# Altium project S7_CAS_lepo3002.PrjPcb (part 3 of 4)

## Sheet PROB_S7CAS_PHY.SchDoc
size Tabloid; SheetNumber: 11; SheetTotal: 15; Sheet_Name: Ethernet Transceiver FPGA; Size: 11x17
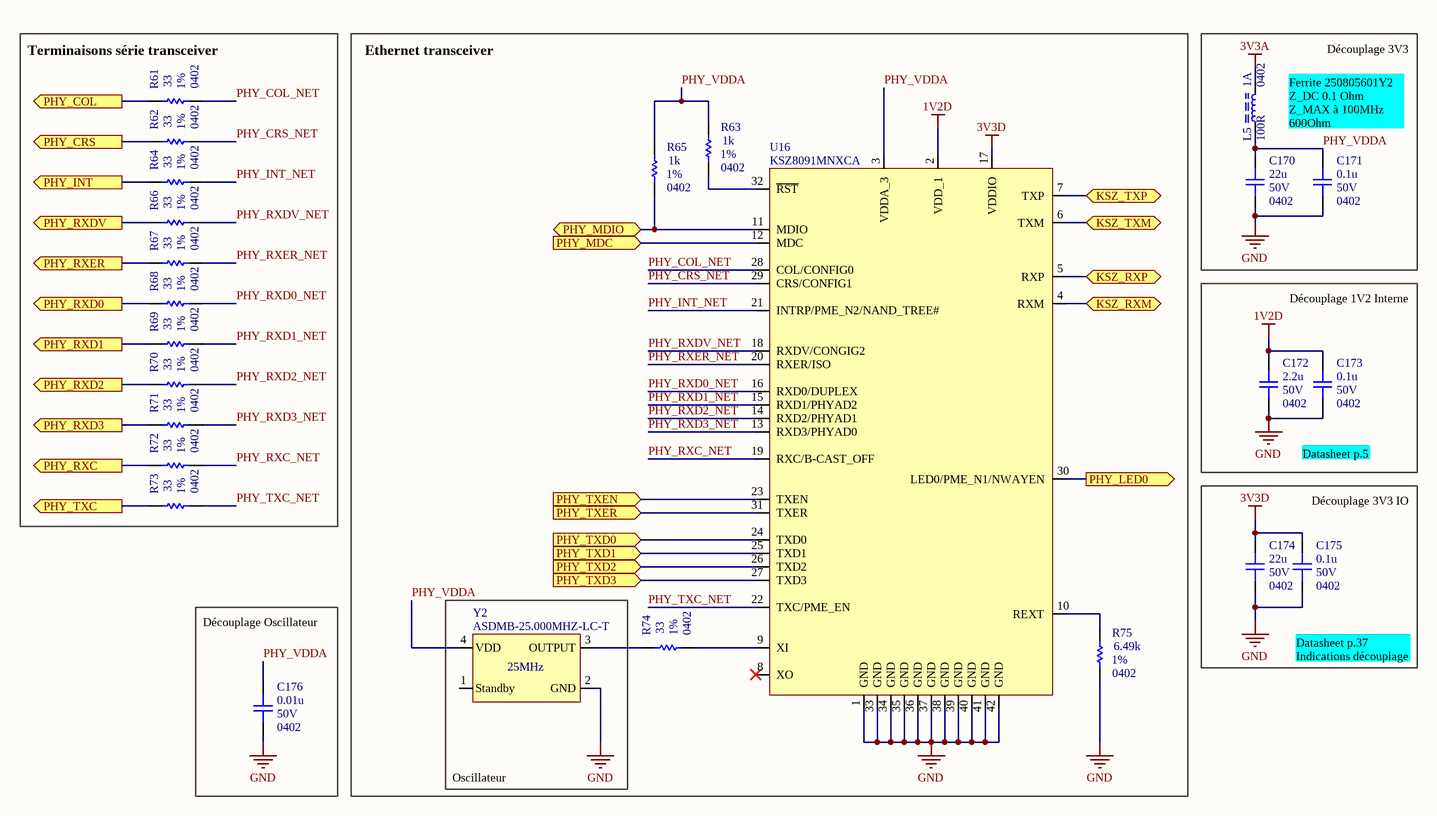
[diagram p10: PROB_S7CAS_PHY.SchDoc]

### Parts
C170  value 22u  Voltage: 50V  Package: 0402  [CAP_0402]  (hidden comment: CAP - 0402)
C171  value 0.1u  Voltage: 50V  Package: 0402  [CAP_0402]  (hidden comment: CAP - 0402)
C172  value 2.2u  Voltage: 50V  Package: 0402  [CAP_0402]  (hidden comment: CAP - 0402)
C173  value 0.1u  Voltage: 50V  Package: 0402  [CAP_0402]  (hidden comment: CAP - 0402)
C174  value 22u  Voltage: 50V  Package: 0402  [CAP_0402]  (hidden comment: CAP - 0402)
C175  value 0.1u  Voltage: 50V  Package: 0402  [CAP_0402]  (hidden comment: CAP - 0402)
C176  value 0.01u  Voltage: 50V  Package: 0402  [CAP_0402]  (hidden comment: CAP - 0402)
L5  value 100R  Current: 1A  Package: 0402  [FER_0402]  (hidden comment: FER - 0402)
R61  value 33  Package: 0402  Precision: 1%  [RES_0402]  (hidden comment: RES - 0402)
R62  value 33  Package: 0402  Precision: 1%  [RES_0402]  (hidden comment: RES - 0402)
R63  value 1k  Package: 0402  Precision: 1%  [RES_0402]  (hidden comment: RES - 0402)
R64  value 33  Package: 0402  Precision: 1%  [RES_0402]  (hidden comment: RES - 0402)
R65  value 1k  Package: 0402  Precision: 1%  [RES_0402]  (hidden comment: RES - 0402)
R66  value 33  Package: 0402  Precision: 1%  [RES_0402]  (hidden comment: RES - 0402)
R67  value 33  Package: 0402  Precision: 1%  [RES_0402]  (hidden comment: RES - 0402)
R68  value 33  Package: 0402  Precision: 1%  [RES_0402]  (hidden comment: RES - 0402)
R69  value 33  Package: 0402  Precision: 1%  [RES_0402]  (hidden comment: RES - 0402)
R70  value 33  Package: 0402  Precision: 1%  [RES_0402]  (hidden comment: RES - 0402)
R71  value 33  Package: 0402  Precision: 1%  [RES_0402]  (hidden comment: RES - 0402)
R72  value 33  Package: 0402  Precision: 1%  [RES_0402]  (hidden comment: RES - 0402)
R73  value 33  Package: 0402  Precision: 1%  [RES_0402]  (hidden comment: RES - 0402)
R74  value 33  Package: 0402  Precision: 1%  [RES_0402]  (hidden comment: RES - 0402)
R75  value 6.49k  Package: 0402  Precision: 1%  [RES_0402]  (hidden comment: RES - 0402)
U16  KSZ8091MNXCA  [COM_ETH_PHY_KSZ8091MNXCA]
Y2  ASDMB-25.000MHZ-LC-T  [OSC_ASDMB-25.000MHZ-LC-T]

### Ports
KSZ_RXM (bidir), KSZ_RXP (bidir), KSZ_TXM (bidir), KSZ_TXP (bidir), PHY_COL (out), PHY_CRS (out), PHY_INT (out), PHY_LED0 (out), PHY_MDC (in), PHY_MDIO (bidir), PHY_RXC (out), PHY_RXD0 (out), PHY_RXD1 (out), PHY_RXD2 (out), PHY_RXD3 (out), PHY_RXDV (out), PHY_RXER (out), PHY_TXC (out), PHY_TXD0 (in), PHY_TXD1 (in), PHY_TXD2 (in), PHY_TXD3 (in), PHY_TXEN (in), PHY_TXER (in)

### Nets
1V2D: C172.2 C173.2 U16.2(VDD_1)
3V3A: L5.1
3V3D: C174.2 C175.2 U16.17(VDDIO)
GND: C170.1 C171.1 C172.1 C173.1 C174.1 C175.1 C176.1 R75.1 U16.1(GND) U16.33(GND) U16.34(GND) U16.35(GND) U16.36(GND) U16.37(GND) U16.38(GND) U16.39(GND) U16.40(GND) U16.41(GND) U16.42(GND) Y2.2(GND)
KSZ_RXM: U16.4(RXM) ; port KSZ_RXM
KSZ_RXP: U16.5(RXP) ; port KSZ_RXP
KSZ_TXM: U16.6(TXM) ; port KSZ_TXM
KSZ_TXP: U16.7(TXP) ; port KSZ_TXP
PHY_COL: R61.2 ; port PHY_COL
PHY_COL_NET: R61.1 U16.28(COL/CONFIG0)
PHY_CRS: R62.2 ; port PHY_CRS
PHY_CRS_NET: R62.1 U16.29(CRS/CONFIG1)
PHY_INT: R64.2 ; port PHY_INT
PHY_INT_NET: R64.1 U16.21(INTRP/PME_N2/NAND_TREE#)
PHY_LED0: U16.30(LED0/PME_N1/NWAYEN) ; port PHY_LED0
PHY_MDC: U16.12(MDC) ; port PHY_MDC
PHY_MDIO: R65.1 U16.11(MDIO) ; port PHY_MDIO
PHY_RXC: R72.2 ; port PHY_RXC
PHY_RXC_NET: R72.1 U16.19(RXC/B-CAST_OFF)
PHY_RXD0: R68.2 ; port PHY_RXD0
PHY_RXD0_NET: R68.1 U16.16(RXD0/DUPLEX)
PHY_RXD1: R69.2 ; port PHY_RXD1
PHY_RXD1_NET: R69.1 U16.15(RXD1/PHYAD2)
PHY_RXD2: R70.2 ; port PHY_RXD2
PHY_RXD2_NET: R70.1 U16.14(RXD2/PHYAD1)
PHY_RXD3: R71.2 ; port PHY_RXD3
PHY_RXD3_NET: R71.1 U16.13(RXD3/PHYAD0)
PHY_RXDV: R66.2 ; port PHY_RXDV
PHY_RXDV_NET: R66.1 U16.18(RXDV/CONGIG2)
PHY_RXER: R67.2 ; port PHY_RXER
PHY_RXER_NET: R67.1 U16.20(RXER/ISO)
PHY_TXC: R73.2 ; port PHY_TXC
PHY_TXC_NET: R73.1 U16.22(TXC/PME_EN)
PHY_TXD0: U16.24(TXD0) ; port PHY_TXD0
PHY_TXD1: U16.25(TXD1) ; port PHY_TXD1
PHY_TXD2: U16.26(TXD2) ; port PHY_TXD2
PHY_TXD3: U16.27(TXD3) ; port PHY_TXD3
PHY_TXEN: U16.23(TXEN) ; port PHY_TXEN
PHY_TXER: U16.31(TXER) ; port PHY_TXER
PHY_VDDA: C170.2 C171.2 C176.2 L5.2 R63.2 R65.2 U16.3(VDDA_3) Y2.4(VDD)
NetR63_1: R63.1 U16.32(~{RST})
NetR74_1: R74.1 U16.9(XI)
NetR74_2: R74.2 Y2.3(OUTPUT)
NetR75_2: R75.2 U16.10(REXT)

Not connected (* = marked no-connect by the designer): U16 8(XO)*; Y2 1(Standby)

### Notes on the sheet
- (near R61) Terminaisons série transceiver
- Ethernet transceiver
- (near L5) Découplage 3V3
- Ferrite 250805601Y2 Z_DC 0.1 Ohm Z_MAX à 100MHz 600Ohm
- Découplage 1V2 Interne
- Datasheet p.5
- Découplage 3V3 IO
- Découplage Oscillateur
- Datasheet p.37 Indications découplage
- Oscillateur
- Sheet Name
- Project Title
- Global Project
- Size
- Group
- Revision
- Date
- Sheet
- of
- Filename
- Designers

### Library data of the parts
C170-C176 = CAP - 0402: Precision: 10%; Current: *; CreatedBy: Jonathan Bouchard; Power: *
R61-R75 = RES - 0402: Voltage: 50V; Power: 1/16W; Current: *; CreatedBy: Jonathan Bouchard
U16 = COM_ETH_PHY_KSZ8091MNXCA: COM - ETHERNET PHY 10/100 - QFN-32; Voltage: 1.8V, 2.5V, 3.3V; Mfg: Micrel; Current: *; Power: *; Mfg Part Number: KSZ8091MNXCA; HelpURL: http://ww1.microchip.com/downloads/en/DeviceDoc/00002275A.pdf; CreatedBy: Jonathan Bouchard; Temperature: 0°C ~ 70°C; Value: *; Precision: *; Package: QFN-32; Supplier 1: Digikey; Supplier Part Number 1: 576-4356-ND
Y2 = OSC_ASDMB-25.000MHZ-LC-T: OSC - 25MHz XO (Standard) LVCMOS - 4-SMD, No Lead; Manufacturer #1: Abracon LLC; Tolerance: ±50ppm; Voltage Rating: 1.8V ~ 3.3V; GRAMS Lib Spec: 2.8; Magnetic Material: Unknown; Polarized: Yes; Value: 25MHz; Current Rating: *; Power Max: *; HelpURL: https://abracon.com/Oscillators/ASDMB.pdf; CreatedBy/Date: Joël Lemay 2019-03-29; VerifiedBy: C. Paulin - 29 mai 2019; Temperature: -40°C ~ +85°C; Package: 4-SMD, No Lead; Manufacturer #2: *; Note: *; Assembly Type: SMD; Part Number #2: *; Part Number #1: ASDMB-25.000MHZ-LC-T; Supplier 1: Digi-Key; Supplier Part Number 1: 535-11730-1-ND; Cryo: UNKNOWN
L5 = FER - 0402: Voltage: *; CreatedBy: Jonathan Bouchard; Power: *; Precision: *

## Sheet PROB_S7CAS_DAC.SchDoc
size Tabloid; SheetNumber: 12; SheetTotal: 15; Sheet_Name: Convertisseur Numérique à Analogique; Size: 11x17
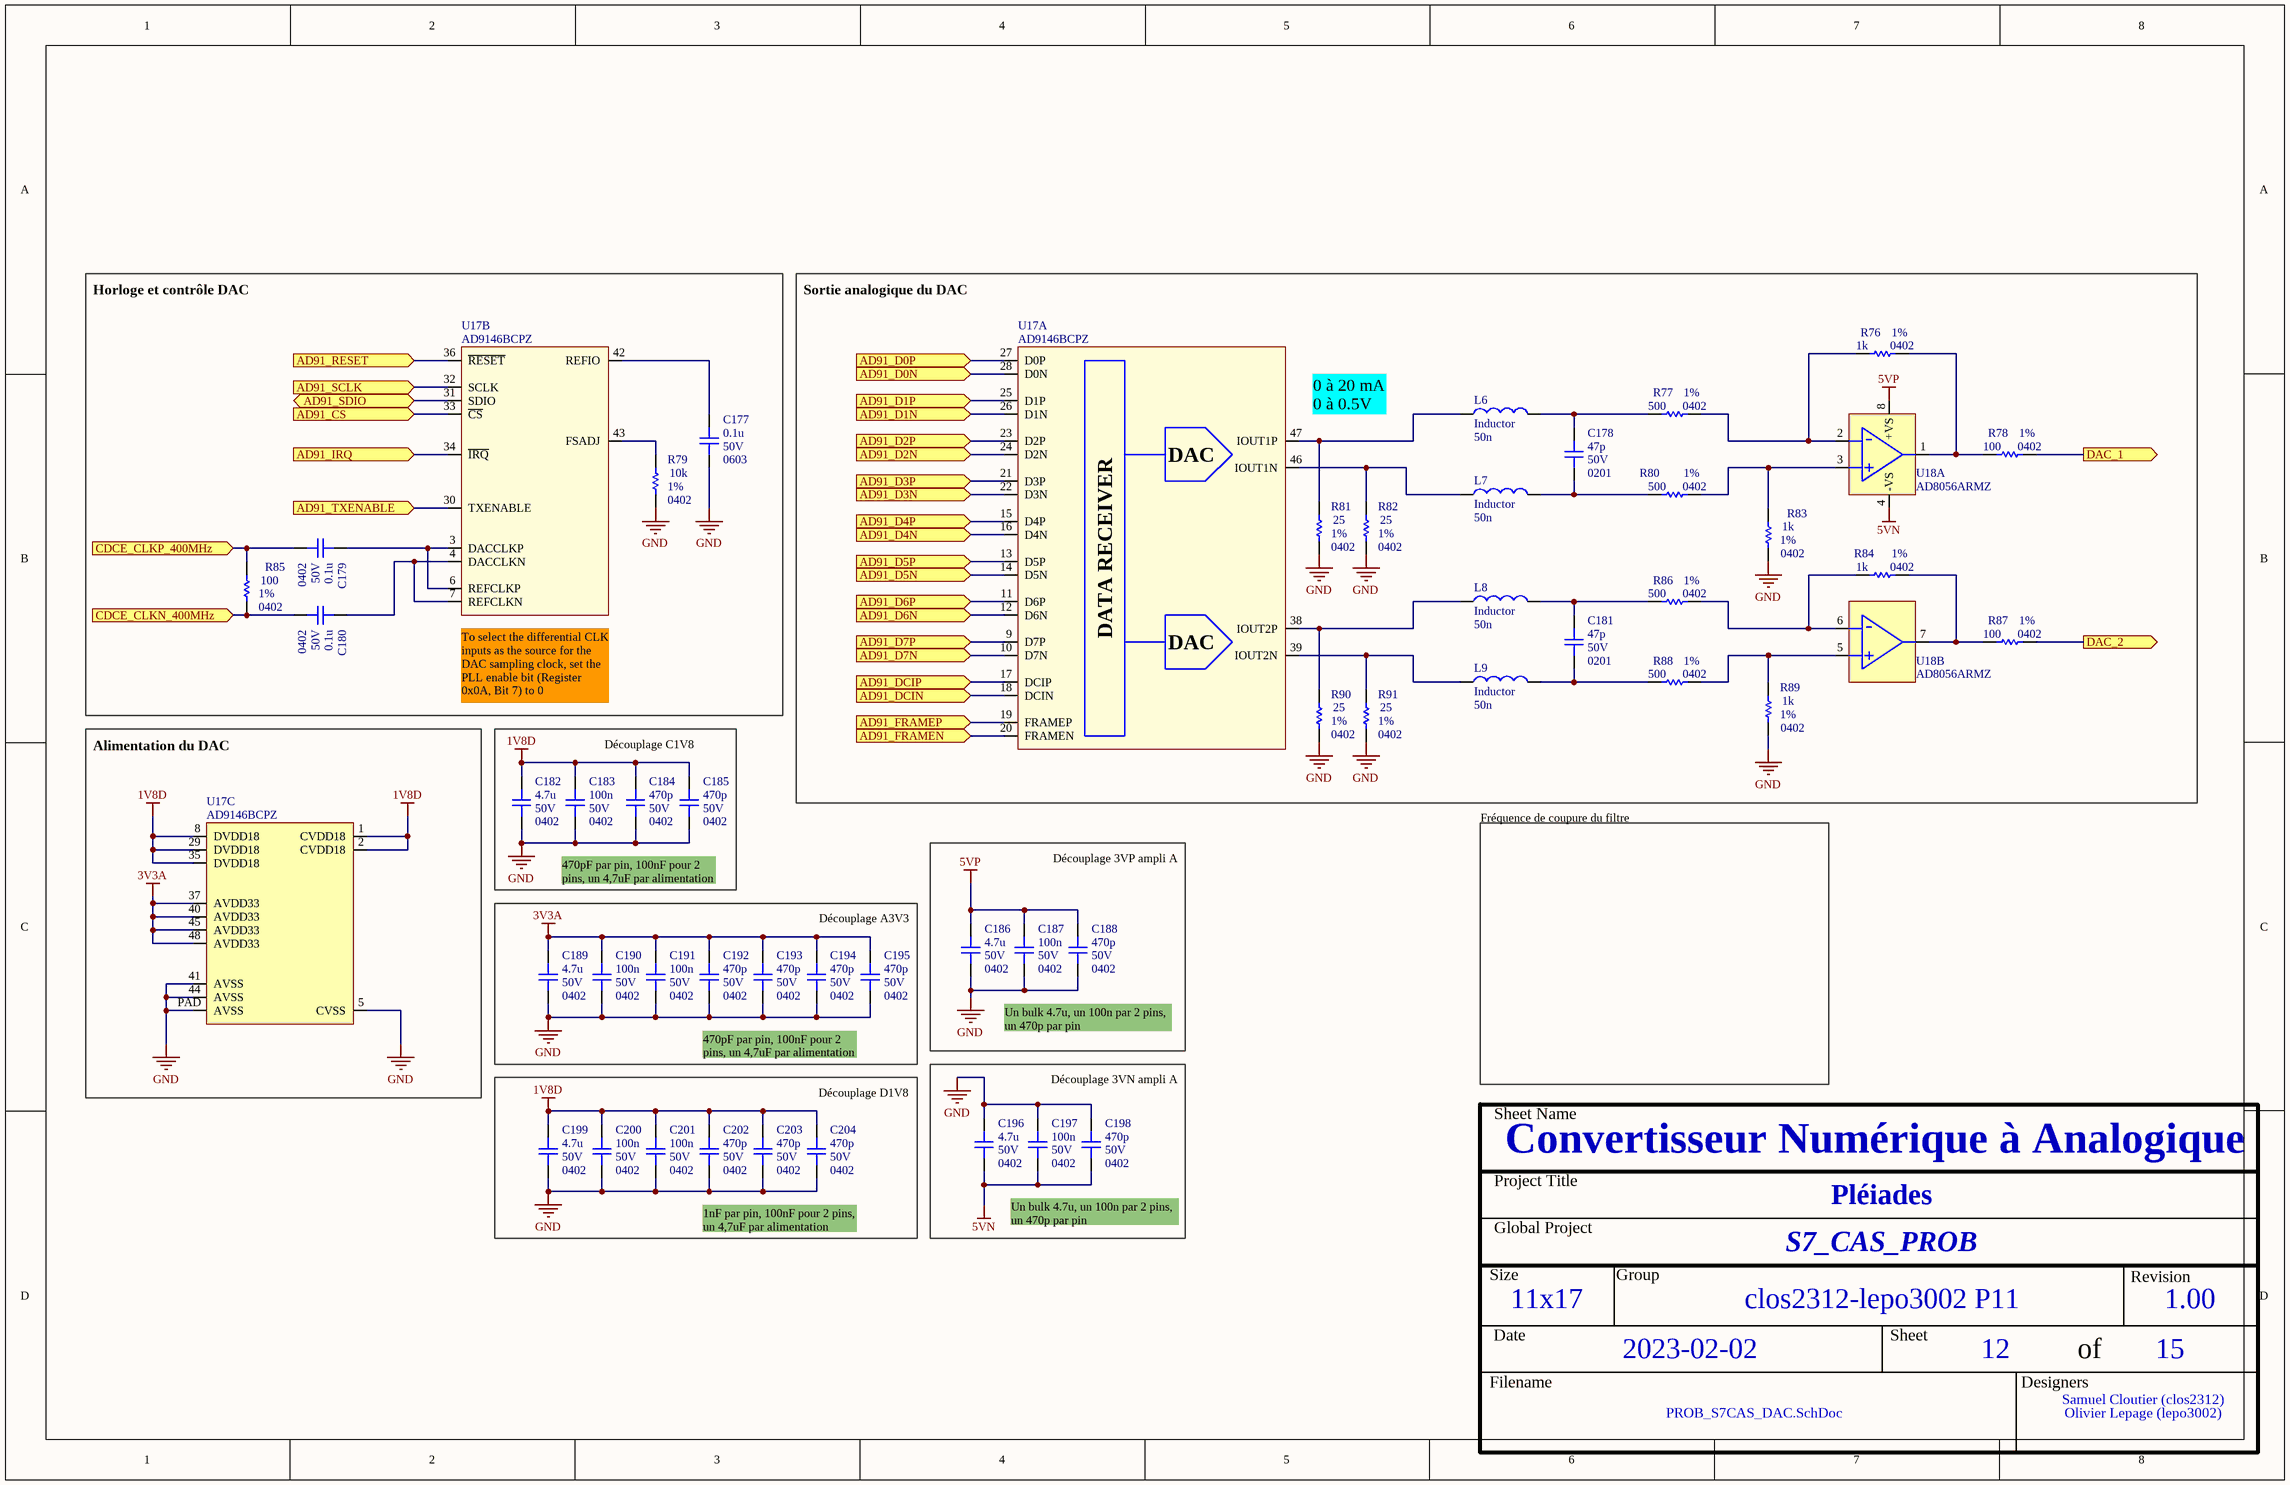
[diagram p11: PROB_S7CAS_DAC.SchDoc]

### Parts
C177  value 0.1u  Voltage: 50V  Package: 0603  [CAP_0603]  (hidden comment: CAP - 0603)
C178  value 47p  Voltage: 50V  Package: 0201  [CAP_0201]  (hidden comment: CAP - 0201)
C179  value 0.1u  Voltage: 50V  Package: 0402  [CAP_0402]  (hidden comment: CAP - 0402)
C180  value 0.1u  Voltage: 50V  Package: 0402  [CAP_0402]  (hidden comment: CAP - 0402)
C181  value 47p  Voltage: 50V  Package: 0201  [CAP_0201]  (hidden comment: CAP - 0201)
C182  value 4.7u  Voltage: 50V  Package: 0402  [CAP_0402]  (hidden comment: CAP - 0402)
C183  value 100n  Voltage: 50V  Package: 0402  [CAP_0402]  (hidden comment: CAP - 0402)
C184  value 470p  Voltage: 50V  Package: 0402  [CAP_0402]  (hidden comment: CAP - 0402)
C185  value 470p  Voltage: 50V  Package: 0402  [CAP_0402]  (hidden comment: CAP - 0402)
C186  value 4.7u  Voltage: 50V  Package: 0402  [CAP_0402]  (hidden comment: CAP - 0402)
C187  value 100n  Voltage: 50V  Package: 0402  [CAP_0402]  (hidden comment: CAP - 0402)
C188  value 470p  Voltage: 50V  Package: 0402  [CAP_0402]  (hidden comment: CAP - 0402)
C189  value 4.7u  Voltage: 50V  Package: 0402  [CAP_0402]  (hidden comment: CAP - 0402)
C190  value 100n  Voltage: 50V  Package: 0402  [CAP_0402]  (hidden comment: CAP - 0402)
C191  value 100n  Voltage: 50V  Package: 0402  [CAP_0402]  (hidden comment: CAP - 0402)
C192  value 470p  Voltage: 50V  Package: 0402  [CAP_0402]  (hidden comment: CAP - 0402)
C193  value 470p  Voltage: 50V  Package: 0402  [CAP_0402]  (hidden comment: CAP - 0402)
C194  value 470p  Voltage: 50V  Package: 0402  [CAP_0402]  (hidden comment: CAP - 0402)
C195  value 470p  Voltage: 50V  Package: 0402  [CAP_0402]  (hidden comment: CAP - 0402)
C196  value 4.7u  Voltage: 50V  Package: 0402  [CAP_0402]  (hidden comment: CAP - 0402)
C197  value 100n  Voltage: 50V  Package: 0402  [CAP_0402]  (hidden comment: CAP - 0402)
C198  value 470p  Voltage: 50V  Package: 0402  [CAP_0402]  (hidden comment: CAP - 0402)
C199  value 4.7u  Voltage: 50V  Package: 0402  [CAP_0402]  (hidden comment: CAP - 0402)
C200  value 100n  Voltage: 50V  Package: 0402  [CAP_0402]  (hidden comment: CAP - 0402)
C201  value 100n  Voltage: 50V  Package: 0402  [CAP_0402]  (hidden comment: CAP - 0402)
C202  value 470p  Voltage: 50V  Package: 0402  [CAP_0402]  (hidden comment: CAP - 0402)
C203  value 470p  Voltage: 50V  Package: 0402  [CAP_0402]  (hidden comment: CAP - 0402)
C204  value 470p  Voltage: 50V  Package: 0402  [CAP_0402]  (hidden comment: CAP - 0402)
L6  Inductor  value 50n  [INDM5250X66N]
L7  Inductor  value 50n  [INDM5250X66N]
L8  Inductor  value 50n  [INDM5250X66N]
L9  Inductor  value 50n  [INDM5250X66N]
R76  value 1k  Package: 0402  Precision: 1%  [RES_0402]  (hidden comment: RES - 0402)
R77  value 500  Package: 0402  Precision: 1%  [RES_0402]  (hidden comment: RES - 0402)
R78  value 100  Package: 0402  Precision: 1%  [RES_0402]  (hidden comment: RES - 0402)
R79  value 10k  Package: 0402  Precision: 1%  [RES_0402]  (hidden comment: RES - 0402)
R80  value 500  Package: 0402  Precision: 1%  [RES_0402]  (hidden comment: RES - 0402)
R81  value 25  Package: 0402  Precision: 1%  [RES_0402]  (hidden comment: RES - 0402)
R82  value 25  Package: 0402  Precision: 1%  [RES_0402]  (hidden comment: RES - 0402)
R83  value 1k  Package: 0402  Precision: 1%  [RES_0402]  (hidden comment: RES - 0402)
R84  value 1k  Package: 0402  Precision: 1%  [RES_0402]  (hidden comment: RES - 0402)
R85  value 100  Package: 0402  Precision: 1%  [RES_0402]  (hidden comment: RES - 0402)
R86  value 500  Package: 0402  Precision: 1%  [RES_0402]  (hidden comment: RES - 0402)
R87  value 100  Package: 0402  Precision: 1%  [RES_0402]  (hidden comment: RES - 0402)
R88  value 500  Package: 0402  Precision: 1%  [RES_0402]  (hidden comment: RES - 0402)
R89  value 1k  Package: 0402  Precision: 1%  [RES_0402]  (hidden comment: RES - 0402)
R90  value 25  Package: 0402  Precision: 1%  [RES_0402]  (hidden comment: RES - 0402)
R91  value 25  Package: 0402  Precision: 1%  [RES_0402]  (hidden comment: RES - 0402)
U17  AD9146BCPZ  [DAC_AD9146BCPZ]  (parts A,B,C of 3)
U18  AD8056ARMZ  [OPAMP_AD8056ARMZ]  (parts A,B of 2)

### Ports
AD91_CS (in), AD91_D0N (in), AD91_D0P (in), AD91_D1N (in), AD91_D1P (in), AD91_D2N (in), AD91_D2P (in), AD91_D3N (in), AD91_D3P (in), AD91_D4N (in), AD91_D4P (in), AD91_D5N (in), AD91_D5P (in), AD91_D6N (in), AD91_D6P (in), AD91_D7N (in), AD91_D7P (in), AD91_DCIN (in), AD91_DCIP (in), AD91_FRAMEN (in), AD91_FRAMEP (in), AD91_IRQ (in), AD91_RESET (in), AD91_SCLK (in), AD91_SDIO (bidir), AD91_TXENABLE (in), CDCE_CLKN_400MHz (in), CDCE_CLKP_400MHz (in), DAC_1 (out), DAC_2 (out)

### Nets
1V8D: C182.2 C183.2 C184.2 C185.2 C199.2 C200.2 C201.2 C202.2 C203.2 C204.2 U17.1(CVDD18) U17.2(CVDD18) U17.8(DVDD18) U17.29(DVDD18) U17.35(DVDD18)
3V3A: C189.2 C190.2 C191.2 C192.2 C193.2 C194.2 C195.2 U17.37(AVDD33) U17.40(AVDD33) U17.45(AVDD33) U17.48(AVDD33)
5VN: C196.1 C197.1 C198.1 U18.4(-VS)
5VP: C186.2 C187.2 C188.2 U18.8(+VS)
GND: C177.1 C182.1 C183.1 C184.1 C185.1 C186.1 C187.1 C188.1 C189.1 C190.1 C191.1 C192.1 C193.1 C194.1 C195.1 C196.2 C197.2 C198.2 C199.1 C200.1 C201.1 C202.1 C203.1 C204.1 R79.1 R81.1 R82.1 R83.1 R89.1 R90.1 R91.1 U17.5(CVSS) U17.41(AVSS) U17.44(AVSS) U17.PAD(AVSS)
AD91_CS: U17.33(~{CS}) ; port AD91_CS
AD91_D0N: U17.28(D0N) ; port AD91_D0N
AD91_D0P: U17.27(D0P) ; port AD91_D0P
AD91_D1N: U17.26(D1N) ; port AD91_D1N
AD91_D1P: U17.25(D1P) ; port AD91_D1P
AD91_D2N: U17.24(D2N) ; port AD91_D2N
AD91_D2P: U17.23(D2P) ; port AD91_D2P
AD91_D3N: U17.22(D3N) ; port AD91_D3N
AD91_D3P: U17.21(D3P) ; port AD91_D3P
AD91_D4N: U17.16(D4N) ; port AD91_D4N
AD91_D4P: U17.15(D4P) ; port AD91_D4P
AD91_D5N: U17.14(D5N) ; port AD91_D5N
AD91_D5P: U17.13(D5P) ; port AD91_D5P
AD91_D6N: U17.12(D6N) ; port AD91_D6N
AD91_D6P: U17.11(D6P) ; port AD91_D6P
AD91_D7N: U17.10(D7N) ; port AD91_D7N
AD91_D7P: U17.9(D7P) ; port AD91_D7P
AD91_DCIN: U17.18(DCIN) ; port AD91_DCIN
AD91_DCIP: U17.17(DCIP) ; port AD91_DCIP
AD91_FRAMEN: U17.20(FRAMEN) ; port AD91_FRAMEN
AD91_FRAMEP: U17.19(FRAMEP) ; port AD91_FRAMEP
AD91_IRQ: U17.34(~{IRQ}) ; port AD91_IRQ
AD91_RESET: U17.36(~{RESET}) ; port AD91_RESET
AD91_SCLK: U17.32(SCLK) ; port AD91_SCLK
AD91_SDIO: U17.31(SDIO) ; port AD91_SDIO
AD91_TXENABLE: U17.30(TXENABLE) ; port AD91_TXENABLE
CDCE_CLKN_400MHz: C180.1 R85.1 ; port CDCE_CLKN_400MHz
CDCE_CLKP_400MHz: C179.1 R85.2 ; port CDCE_CLKP_400MHz
DAC_1: R78.2 ; port DAC_1
DAC_2: R87.2 ; port DAC_2
NetC177_2: C177.2 U17.42(REFIO)
NetC178_1: C178.1 L7.2 R80.1
NetC178_2: C178.2 L6.2 R77.1
NetC179_2: C179.2 U17.3(DACCLKP) U17.6(REFCLKP)
NetC180_2: C180.2 U17.4(DACCLKN) U17.7(REFCLKN)
NetC181_1: C181.1 L9.2 R88.1
NetC181_2: C181.2 L8.2 R86.1
NetL6_1: L6.1 R81.2 U17.47(IOUT1P)
NetL7_1: L7.1 R82.2 U17.46(IOUT1N)
NetL8_1: L8.1 R90.2 U17.38(IOUT2P)
NetL9_1: L9.1 R91.2 U17.39(IOUT2N)
NetR76_1: R76.1 R77.2 U18.2(-IN1)
NetR76_2: R76.2 R78.1 U18.1(OUT1)
NetR79_2: R79.2 U17.43(FSADJ)
NetR80_2: R80.2 R83.2 U18.3(+IN1)
NetR84_1: R84.1 R86.2 U18.6(-IN2)
NetR84_2: R84.2 R87.1 U18.7(OUT2)
NetR88_2: R88.2 R89.2 U18.5(+IN2)

### Notes on the sheet
- Horloge et contrôle DAC
- Sortie analogique du DAC
- (near U17) 0 à 20 mA 0 à 0.5V
- (near U17) To select the differential CLK inputs as the source for the DAC sampling clock, set the PLL enable bit (Register 0x0A, Bit 7) to 0
- Alimentation du DAC
- Découplage C1V8
- Fréquence de coupure du filtre
- 470pF par pin, 100nF pour 2 pins, un 4,7uF par alimentation
- Découplage 3VP ampli A
- Découplage A3V3
- Un bulk 4.7u, un 100n par 2 pins, un 470p par pin
- Découplage D1V8
- Découplage 3VN ampli A
- 1nF par pin, 100nF pour 2 pins, un 4,7uF par alimentation
- Sheet Name
- Project Title
- Global Project
- Size
- Group
- Revision
- Date
- Sheet
- of
- Filename
- Designers
- (in symbol DAC_AD9146BCPZ, part A) DAC; DATA RECEIVER

### Library data of the parts
C177 = CAP - 0603: Precision: 10%; Current: *; CreatedBy: Jonathan Bouchard; Power: *
C178 C181 = CAP - 0201: Precision: 10%; Current: *; CreatedBy: Jonathan Bouchard; Power: *
C179 C180 C182-C204 = CAP - 0402: Precision: 10%; Current: *; CreatedBy: Jonathan Bouchard; Power: *
L6-L9 = Inductor: IND PWR BEAD 50NH 48A SMD; GRAMS Lib Spec: 2.7; HelpURL: https://productfinder.pulseelectronics.com/api/open/part-attachments/datasheet/pa5190.500hlt
R76-R91 = RES - 0402: Voltage: 50V; Power: 1/16W; Current: *; CreatedBy: Jonathan Bouchard
U17 = DAC_AD9146BCPZ: DAC - 16BIT SRL HIGH SPEED - QFN-48; Voltage: 3.13 V ~ 3.47 V / 1.71 V ~ 1.89 V; Mfg: Analog Devices Inc.; Current: *; Power: *; Mfg Part Number: AD9146BCPZ; HelpURL: http://www.analog.com/media/en/technical-documentation/data-sheets/AD9146.PDF; CreatedBy: Jonathan Bouchard; Temperature: -40°C ~ 85°C; Value: *; Precision: 16 Bit; Package: QFN-48; Supplier 1: Digikey; Supplier Part Number 1: AD9146BCPZ-ND
U18 = OPAMP_AD8056ARMZ: OPAMP - VFB 300MHZ - 8MSOP; Voltage: 8 V ~ 12 V, ±4 V ~ 6 V; Current: 60mA; Mfg: Analog Devices; Power: *; Mfg Part Number: AD8056ARMZ; HelpURL: http://www.analog.com/media/en/technical-documentation/data-sheets/AD8055_8056.pdf; CreatedBy: Jonathan Bouchard; Temperature: -40°C ~ 125°C; Value: *; Precision: *; Package: MSOP-8; Supplier 1: Digikey; Supplier Part Number 1: AD8056ARMZ-REEL7CT-ND

## Sheet PROB_S7CAS_ADC.SchDoc
size Tabloid; SheetNumber: 13; SheetTotal: 15; Sheet_Name: Convertisseur Analogique à Numérique; Size: 11x17
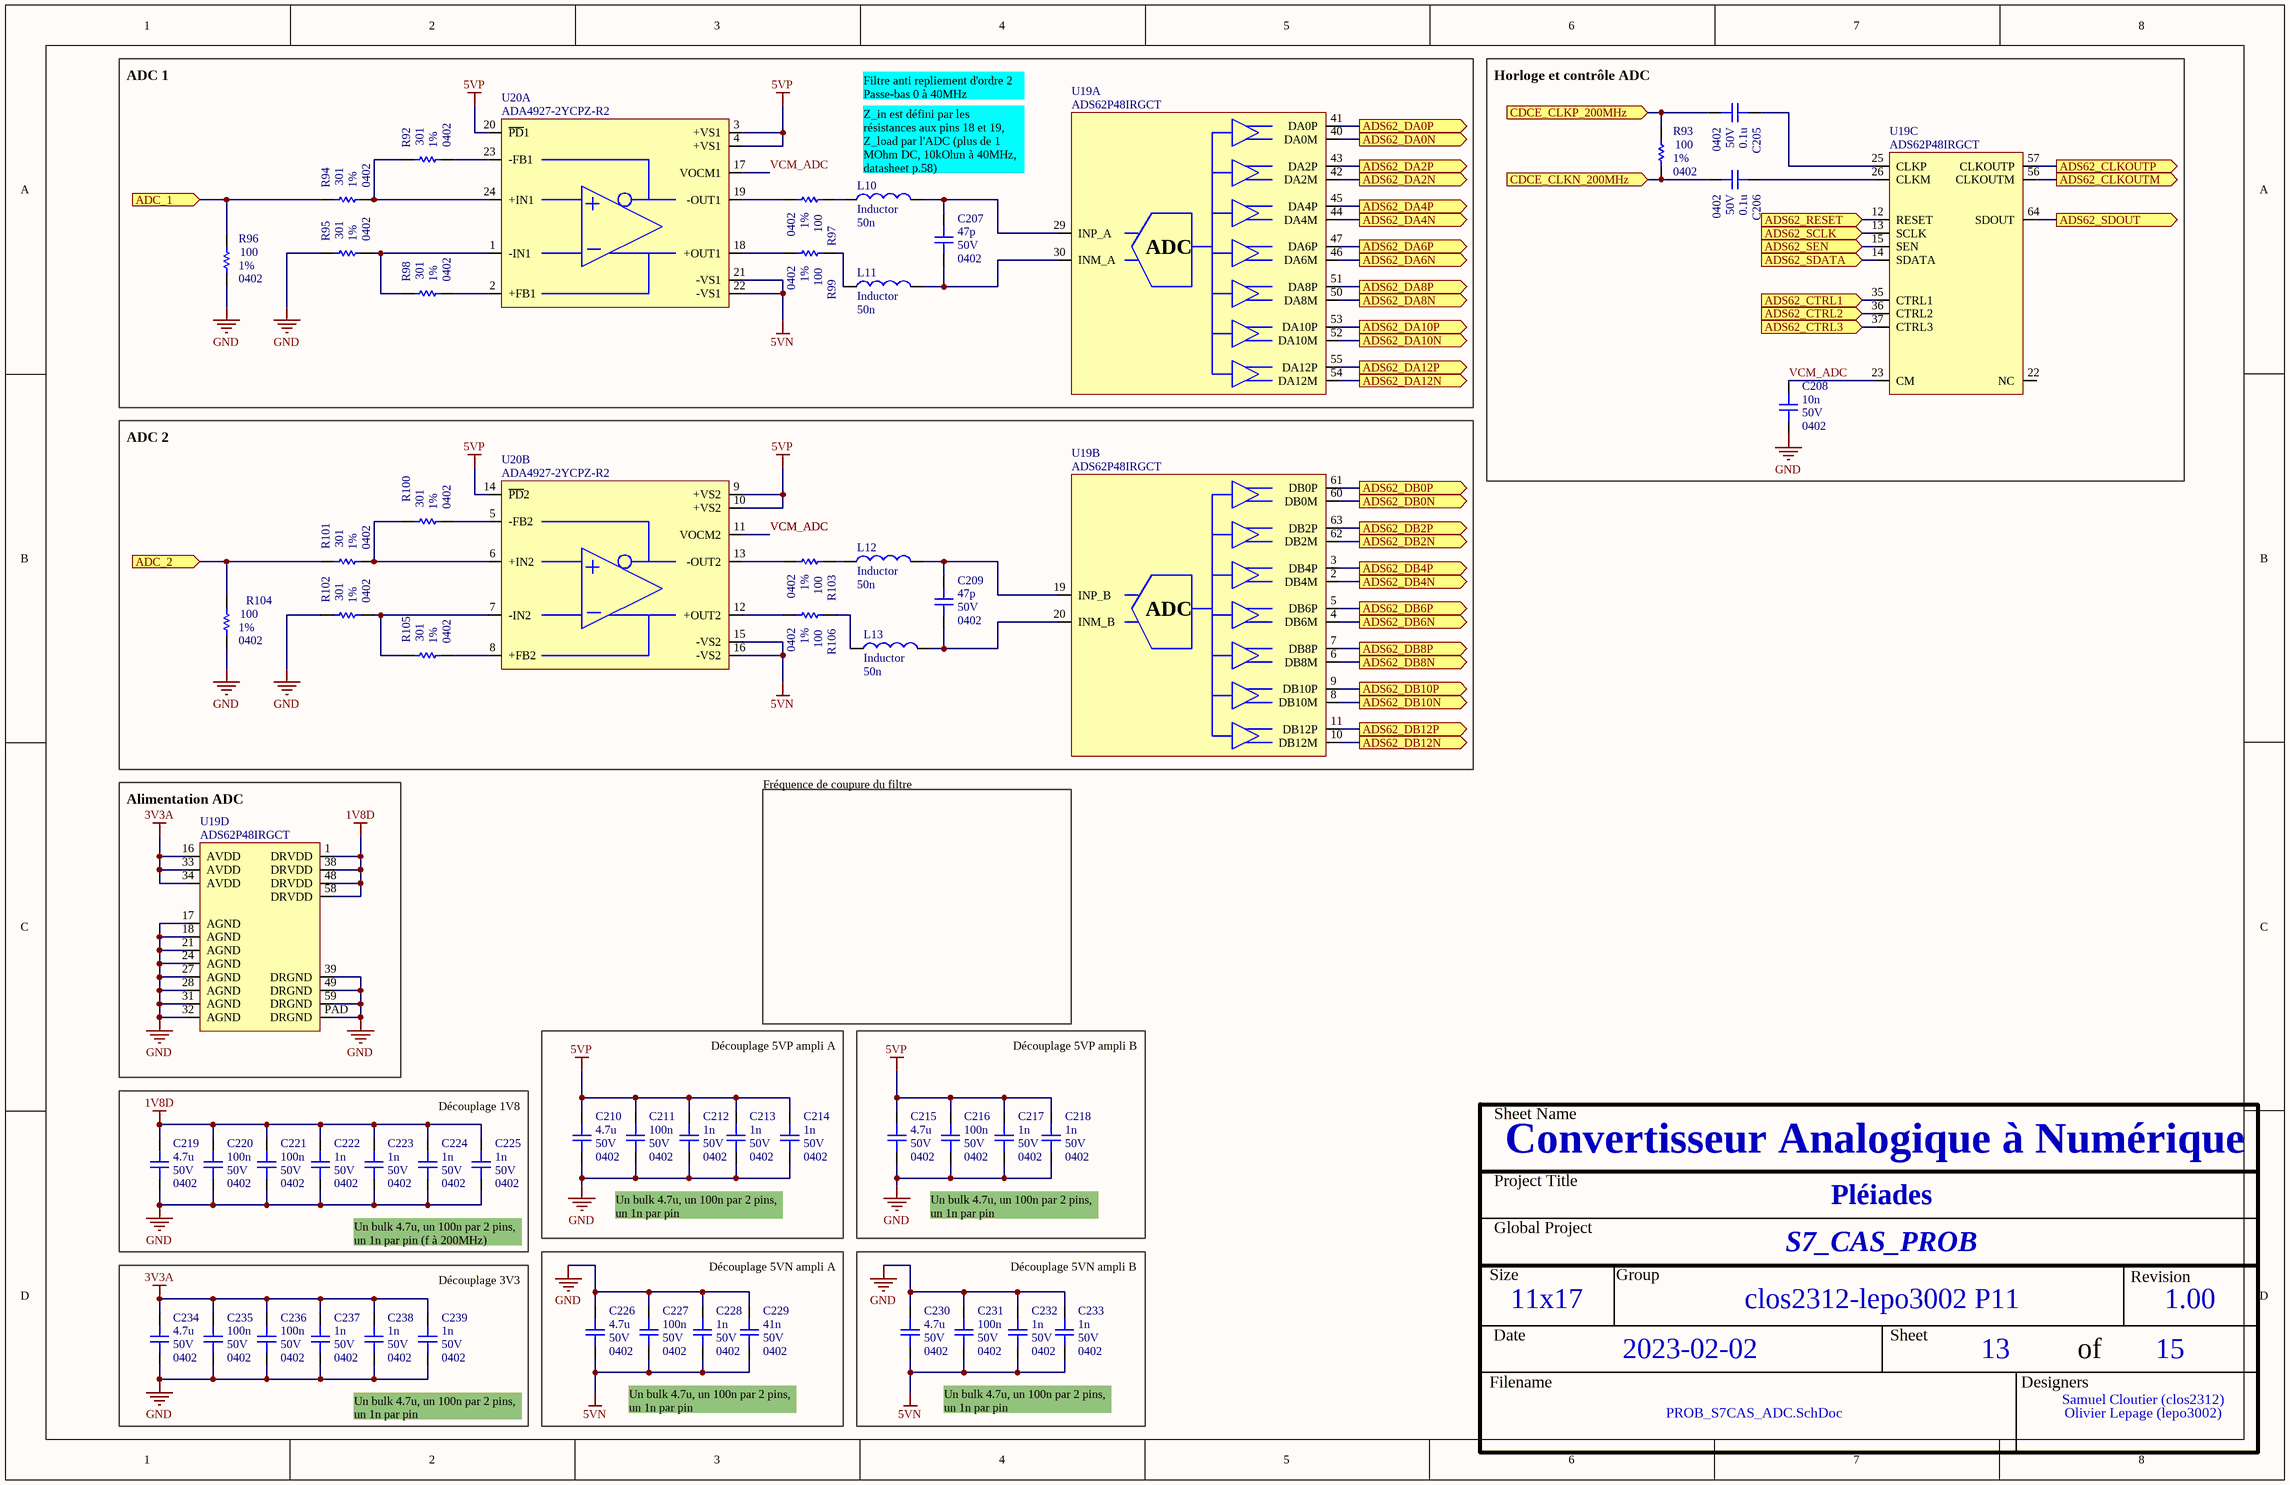
[diagram p12: PROB_S7CAS_ADC.SchDoc]

### Parts
C205  value 0.1u  Voltage: 50V  Package: 0402  [CAP_0402]  (hidden comment: CAP - 0402)
C206  value 0.1u  Voltage: 50V  Package: 0402  [CAP_0402]  (hidden comment: CAP - 0402)
C207  value 47p  Voltage: 50V  Package: 0402  [CAP_0402]  (hidden comment: CAP - 0402)
C208  value 10n  Voltage: 50V  Package: 0402  [CAP_0402]  (hidden comment: CAP - 0402)
C209  value 47p  Voltage: 50V  Package: 0402  [CAP_0402]  (hidden comment: CAP - 0402)
C210  value 4.7u  Voltage: 50V  Package: 0402  [CAP_0402]  (hidden comment: CAP - 0402)
C211  value 100n  Voltage: 50V  Package: 0402  [CAP_0402]  (hidden comment: CAP - 0402)
C212  value 1n  Voltage: 50V  Package: 0402  [CAP_0402]  (hidden comment: CAP - 0402)
C213  value 1n  Voltage: 50V  Package: 0402  [CAP_0402]  (hidden comment: CAP - 0402)
C214  value 1n  Voltage: 50V  Package: 0402  [CAP_0402]  (hidden comment: CAP - 0402)
C215  value 4.7u  Voltage: 50V  Package: 0402  [CAP_0402]  (hidden comment: CAP - 0402)
C216  value 100n  Voltage: 50V  Package: 0402  [CAP_0402]  (hidden comment: CAP - 0402)
C217  value 1n  Voltage: 50V  Package: 0402  [CAP_0402]  (hidden comment: CAP - 0402)
C218  value 1n  Voltage: 50V  Package: 0402  [CAP_0402]  (hidden comment: CAP - 0402)
C219  value 4.7u  Voltage: 50V  Package: 0402  [CAP_0402]  (hidden comment: CAP - 0402)
C220  value 100n  Voltage: 50V  Package: 0402  [CAP_0402]  (hidden comment: CAP - 0402)
C221  value 100n  Voltage: 50V  Package: 0402  [CAP_0402]  (hidden comment: CAP - 0402)
C222  value 1n  Voltage: 50V  Package: 0402  [CAP_0402]  (hidden comment: CAP - 0402)
C223  value 1n  Voltage: 50V  Package: 0402  [CAP_0402]  (hidden comment: CAP - 0402)
C224  value 1n  Voltage: 50V  Package: 0402  [CAP_0402]  (hidden comment: CAP - 0402)
C225  value 1n  Voltage: 50V  Package: 0402  [CAP_0402]  (hidden comment: CAP - 0402)
C226  value 4.7u  Voltage: 50V  Package: 0402  [CAP_0402]  (hidden comment: CAP - 0402)
C227  value 100n  Voltage: 50V  Package: 0402  [CAP_0402]  (hidden comment: CAP - 0402)
C228  value 1n  Voltage: 50V  Package: 0402  [CAP_0402]  (hidden comment: CAP - 0402)
C229  value 41n  Voltage: 50V  Package: 0402  [CAP_0402]  (hidden comment: CAP - 0402)
C230  value 4.7u  Voltage: 50V  Package: 0402  [CAP_0402]  (hidden comment: CAP - 0402)
C231  value 100n  Voltage: 50V  Package: 0402  [CAP_0402]  (hidden comment: CAP - 0402)
C232  value 1n  Voltage: 50V  Package: 0402  [CAP_0402]  (hidden comment: CAP - 0402)
C233  value 1n  Voltage: 50V  Package: 0402  [CAP_0402]  (hidden comment: CAP - 0402)
C234  value 4.7u  Voltage: 50V  Package: 0402  [CAP_0402]  (hidden comment: CAP - 0402)
C235  value 100n  Voltage: 50V  Package: 0402  [CAP_0402]  (hidden comment: CAP - 0402)
C236  value 100n  Voltage: 50V  Package: 0402  [CAP_0402]  (hidden comment: CAP - 0402)
C237  value 1n  Voltage: 50V  Package: 0402  [CAP_0402]  (hidden comment: CAP - 0402)
C238  value 1n  Voltage: 50V  Package: 0402  [CAP_0402]  (hidden comment: CAP - 0402)
C239  value 1n  Voltage: 50V  Package: 0402  [CAP_0402]  (hidden comment: CAP - 0402)
L10  Inductor  value 50n  [INDM5250X66N]
L11  Inductor  value 50n  [INDM5250X66N]
L12  Inductor  value 50n  [INDM5250X66N]
L13  Inductor  value 50n  [INDM5250X66N]
R92  value 301  Package: 0402  Precision: 1%  [RES_0402]  (hidden comment: RES - 0402)
R93  value 100  Package: 0402  Precision: 1%  [RES_0402]  (hidden comment: RES - 0402)
R94  value 301  Package: 0402  Precision: 1%  [RES_0402]  (hidden comment: RES - 0402)
R95  value 301  Package: 0402  Precision: 1%  [RES_0402]  (hidden comment: RES - 0402)
R96  value 100  Package: 0402  Precision: 1%  [RES_0402]  (hidden comment: RES - 0402)
R97  value 100  Package: 0402  Precision: 1%  [RES_0402]  (hidden comment: RES - 0402)
R98  value 301  Package: 0402  Precision: 1%  [RES_0402]  (hidden comment: RES - 0402)
R99  value 100  Package: 0402  Precision: 1%  [RES_0402]  (hidden comment: RES - 0402)
R100  value 301  Package: 0402  Precision: 1%  [RES_0402]  (hidden comment: RES - 0402)
R101  value 301  Package: 0402  Precision: 1%  [RES_0402]  (hidden comment: RES - 0402)
R102  value 301  Package: 0402  Precision: 1%  [RES_0402]  (hidden comment: RES - 0402)
R103  value 100  Package: 0402  Precision: 1%  [RES_0402]  (hidden comment: RES - 0402)
R104  value 100  Package: 0402  Precision: 1%  [RES_0402]  (hidden comment: RES - 0402)
R105  value 301  Package: 0402  Precision: 1%  [RES_0402]  (hidden comment: RES - 0402)
R106  value 100  Package: 0402  Precision: 1%  [RES_0402]  (hidden comment: RES - 0402)
U19  ADS62P48IRGCT  [ADC_ADS62P48IRGCT]  (parts A,B,C,D of 4)
U20  ADA4927-2YCPZ-R2  [OPAMP_ADA4927-2YCPZ-R2]  (parts A,B of 2)

### Ports
ADC_1 (in), ADC_2 (in), ADS62_CLKOUTM (out), ADS62_CLKOUTP (out), ADS62_CTRL1 (in), ADS62_CTRL2 (in), ADS62_CTRL3 (in), ADS62_DA0N (out), ADS62_DA0P (out), ADS62_DA2N (out), ADS62_DA2P (out), ADS62_DA4N (out), ADS62_DA4P (out), ADS62_DA6N (out), ADS62_DA6P (out), ADS62_DA8N (out), ADS62_DA8P (out), ADS62_DA10N (out), ADS62_DA10P (out), ADS62_DA12N (out), ADS62_DA12P (out), ADS62_DB0N (out), ADS62_DB0P (out), ADS62_DB2N (out), ADS62_DB2P (out), ADS62_DB4N (out), ADS62_DB4P (out), ADS62_DB6N (out), ADS62_DB6P (out), ADS62_DB8N (out), ADS62_DB8P (out), ADS62_DB10N (out), ADS62_DB10P (out), ADS62_DB12N (out), ADS62_DB12P (out), ADS62_RESET (in), ADS62_SCLK (in), ADS62_SDATA (in), ADS62_SDOUT (out), ADS62_SEN (in), CDCE_CLKN_200MHz (in), CDCE_CLKP_200MHz (in)

### Nets
1V8D: C219.2 C220.2 C221.2 C222.2 C223.2 C224.2 C225.2 U19.1(DRVDD) U19.38(DRVDD) U19.48(DRVDD) U19.58(DRVDD)
3V3A: C234.2 C235.2 C236.2 C237.2 C238.2 C239.2 U19.16(AVDD) U19.33(AVDD) U19.34(AVDD)
5VN: C226.1 C227.1 C228.1 C229.1 C230.1 C231.1 C232.1 C233.1 U20.15(-VS2) U20.16(-VS2) U20.21(-VS1) U20.22(-VS1)
5VP: C210.2 C211.2 C212.2 C213.2 C214.2 C215.2 C216.2 C217.2 C218.2 U20.3(+VS1) U20.4(+VS1) U20.9(+VS2) U20.10(+VS2) U20.14(~{PD}2) U20.20(~{PD}1)
GND: C208.1 C210.1 C211.1 C212.1 C213.1 C214.1 C215.1 C216.1 C217.1 C218.1 C219.1 C220.1 C221.1 C222.1 C223.1 C224.1 C225.1 C226.2 C227.2 C228.2 C229.2 C230.2 C231.2 C232.2 C233.2 C234.1 C235.1 C236.1 C237.1 C238.1 C239.1 R95.2 R96.1 R102.2 R104.1 U19.17(AGND) U19.18(AGND) U19.21(AGND) U19.24(AGND) U19.27(AGND) U19.28(AGND) U19.31(AGND) U19.32(AGND) U19.39(DRGND) U19.49(DRGND) U19.59(DRGND) U19.PAD(DRGND)
ADC_1: R94.2 R96.2 ; port ADC_1
ADC_2: R101.2 R104.2 ; port ADC_2
ADS62_CLKOUTM: U19.56(CLKOUTM) ; port ADS62_CLKOUTM
ADS62_CLKOUTP: U19.57(CLKOUTP) ; port ADS62_CLKOUTP
ADS62_CTRL1: U19.35(CTRL1) ; port ADS62_CTRL1
ADS62_CTRL2: U19.36(CTRL2) ; port ADS62_CTRL2
ADS62_CTRL3: U19.37(CTRL3) ; port ADS62_CTRL3
ADS62_DA0N: U19.40(DA0M) ; port ADS62_DA0N
ADS62_DA0P: U19.41(DA0P) ; port ADS62_DA0P
ADS62_DA2N: U19.42(DA2M) ; port ADS62_DA2N
ADS62_DA2P: U19.43(DA2P) ; port ADS62_DA2P
ADS62_DA4N: U19.44(DA4M) ; port ADS62_DA4N
ADS62_DA4P: U19.45(DA4P) ; port ADS62_DA4P
ADS62_DA6N: U19.46(DA6M) ; port ADS62_DA6N
ADS62_DA6P: U19.47(DA6P) ; port ADS62_DA6P
ADS62_DA8N: U19.50(DA8M) ; port ADS62_DA8N
ADS62_DA8P: U19.51(DA8P) ; port ADS62_DA8P
ADS62_DA10N: U19.52(DA10M) ; port ADS62_DA10N
ADS62_DA10P: U19.53(DA10P) ; port ADS62_DA10P
ADS62_DA12N: U19.54(DA12M) ; port ADS62_DA12N
ADS62_DA12P: U19.55(DA12P) ; port ADS62_DA12P
ADS62_DB0N: U19.60(DB0M) ; port ADS62_DB0N
ADS62_DB0P: U19.61(DB0P) ; port ADS62_DB0P
ADS62_DB2N: U19.62(DB2M) ; port ADS62_DB2N
ADS62_DB2P: U19.63(DB2P) ; port ADS62_DB2P
ADS62_DB4N: U19.2(DB4M) ; port ADS62_DB4N
ADS62_DB4P: U19.3(DB4P) ; port ADS62_DB4P
ADS62_DB6N: U19.4(DB6M) ; port ADS62_DB6N
ADS62_DB6P: U19.5(DB6P) ; port ADS62_DB6P
ADS62_DB8N: U19.6(DB8M) ; port ADS62_DB8N
ADS62_DB8P: U19.7(DB8P) ; port ADS62_DB8P
ADS62_DB10N: U19.8(DB10M) ; port ADS62_DB10N
ADS62_DB10P: U19.9(DB10P) ; port ADS62_DB10P
ADS62_DB12N: U19.10(DB12M) ; port ADS62_DB12N
ADS62_DB12P: U19.11(DB12P) ; port ADS62_DB12P
ADS62_RESET: U19.12(RESET) ; port ADS62_RESET
ADS62_SCLK: U19.13(SCLK) ; port ADS62_SCLK
ADS62_SDATA: U19.14(SDATA) ; port ADS62_SDATA
ADS62_SDOUT: U19.64(SDOUT) ; port ADS62_SDOUT
ADS62_SEN: U19.15(SEN) ; port ADS62_SEN
CDCE_CLKN_200MHz: C206.1 R93.1 ; port CDCE_CLKN_200MHz
CDCE_CLKP_200MHz: C205.1 R93.2 ; port CDCE_CLKP_200MHz
VCM_ADC: C208.2 U19.23(CM) U20.11(VOCM2) U20.17(VOCM1)
NetC205_2: C205.2 U19.25(CLKP)
NetC206_2: C206.2 U19.26(CLKM)
NetC207_1: C207.1 L11.2 U19.30(INM_A)
NetC207_2: C207.2 L10.2 U19.29(INP_A)
NetC209_1: C209.1 L13.2 U19.20(INM_B)
NetC209_2: C209.2 L12.2 U19.19(INP_B)
NetL10_1: L10.1 R97.2
NetL11_1: L11.1 R99.2
NetL12_1: L12.1 R103.2
NetL13_1: L13.1 R106.2
NetR92_1: R92.1 U20.23(-FB1)
NetR92_2: R92.2 R94.1 U20.24(+IN1)
NetR95_1: R95.1 R98.2 U20.1(-IN1)
NetR97_1: R97.1 U20.19(-OUT1)
NetR98_1: R98.1 U20.2(+FB1)
NetR99_1: R99.1 U20.18(+OUT1)
NetR100_1: R100.1 U20.5(-FB2)
NetR100_2: R100.2 R101.1 U20.6(+IN2)
NetR102_1: R102.1 R105.2 U20.7(-IN2)
NetR103_1: R103.1 U20.13(-OUT2)
NetR105_1: R105.1 U20.8(+FB2)
NetR106_1: R106.1 U20.12(+OUT2)

Not connected (* = marked no-connect by the designer): U19 22(NC)

### Notes on the sheet
- ADC 1
- Filtre anti repliement d'ordre 2 Passe-bas 0 à 40MHz
- (near C205) Horloge et contrôle ADC
- (near L10) Z_in est défini par les résistances aux pins 18 et 19, Z_load par l'ADC (plus de 1 MOhm DC, 10kOhm à 40MHz, datasheet p.58)
- ADC 2
- (near U19) Alimentation ADC
- Fréquence de coupure du filtre
- Découplage 5VP ampli A
- Découplage 5VP ampli B
- Découplage 1V8
- Un bulk 4.7u, un 100n par 2 pins, un 1n par pin (f à 200MHz)
- Un bulk 4.7u, un 100n par 2 pins, un 1n par pin
- Découplage 3V3
- Découplage 5VN ampli A
- Découplage 5VN ampli B
- Sheet Name
- Project Title
- Global Project
- Size
- Group
- Revision
- Date
- Sheet
- of
- Filename
- Designers
- (in symbol ADC_ADS62P48IRGCT, part A) ADC
- (in symbol ADC_ADS62P48IRGCT, part B) ADC

### Library data of the parts
C205-C239 = CAP - 0402: Precision: 10%; Current: *; CreatedBy: Jonathan Bouchard; Power: *
L10-L13 = Inductor: IND PWR BEAD 50NH 48A SMD; GRAMS Lib Spec: 2.7; HelpURL: https://productfinder.pulseelectronics.com/api/open/part-attachments/datasheet/pa5190.500hlt
R92-R106 = RES - 0402: Voltage: 50V; Power: 1/16W; Current: *; CreatedBy: Jonathan Bouchard
U19 = ADC_ADS62P48IRGCT: ADC - 14 BIT 210MSPS SUAL - VQFN-64; Voltage: 3.15 V ~ 3.6 V / 1.7 V ~ 1.9 V; Mfg: Texas Instruments; Precision: 14 Bit; Current: *; Power: *; Mfg Part Number: ADS62P48IRGCT; HelpURL: http://www.ti.com/lit/ds/symlink/ads62p48.pdf; CreatedBy: Jonathan Bouchard; Temperature: -40°C ~ 85°C; Value: *; Package: VQFN-64; Supplier 1: Digikey; Supplier Part Number 1: 296-24611-1-ND
U20 = OPAMP_ADA4927-2YCPZ-R2: OPAMP - CFA 2.3GHZ - QFN-24; Voltage: 4.5 V ~ 11 V, ±2.25 V ~ 5.5 V; Current: 65mA; Mfg: Analog Devices; Power: *; Mfg Part Number: ADA4927-2YCPZ-R2; HelpURL: http://www.analog.com/media/en/technical-documentation/data-sheets/ADA4927-1_4927-2.pdf; CreatedBy: Jonathan Bouchard; Temperature: -40°C ~ 105°C; Value: *; Precision: *; Package: QFN-24; Supplier 1: Digikey; Supplier Part Number 1: ADA4927-2YCPZ-R2CT-ND

## Sheet PROB_S7CAS_MOTDRIVER.SchDoc
size Tabloid; SheetNumber: 14; SheetTotal: 15; Sheet_Name: Contrôle du moteur; Size: 11x17
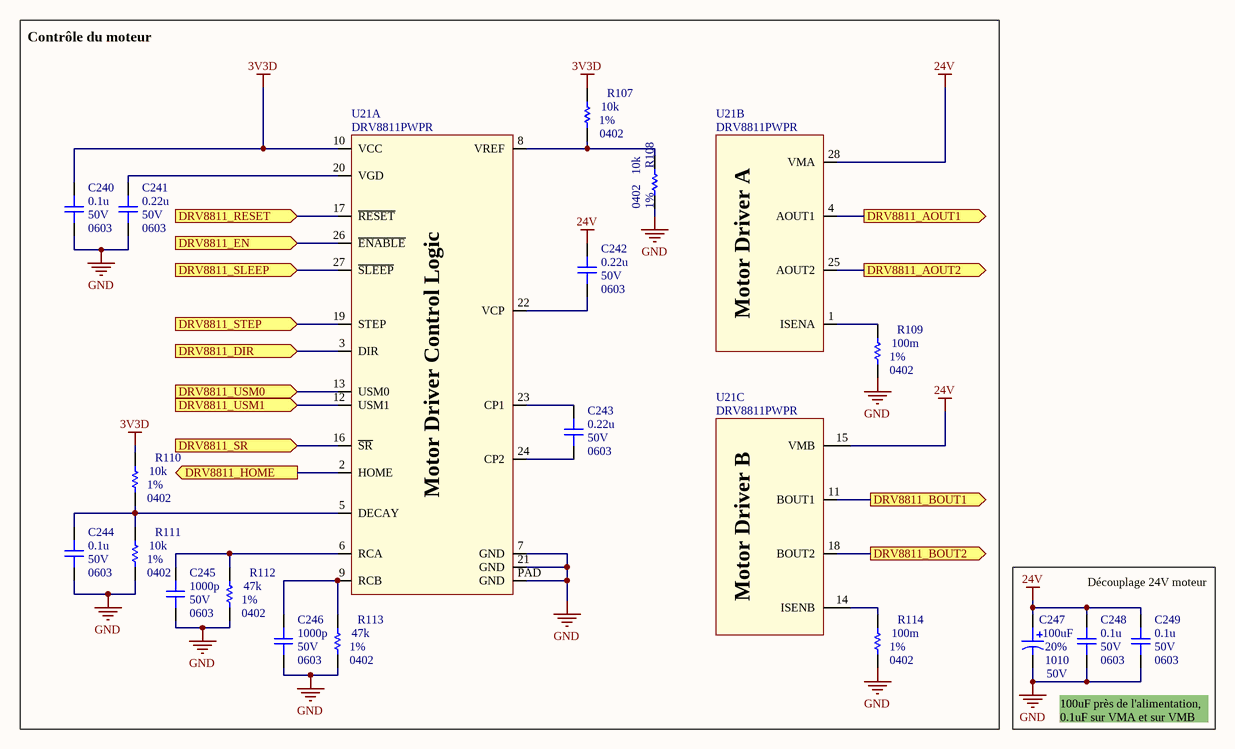
[diagram p13: PROB_S7CAS_MOTDRIVER.SchDoc]

### Parts
C240  value 0.1u  Voltage: 50V  Package: 0603  [CAP_0603]  (hidden comment: CAP - 0603)
C241  value 0.22u  Voltage: 50V  Package: 0603  [CAP_0603]  (hidden comment: CAP - 0603)
C242  value 0.22u  Voltage: 50V  Package: 0603  [CAP_0603]  (hidden comment: CAP - 0603)
C243  value 0.22u  Voltage: 50V  Package: 0603  [CAP_0603]  (hidden comment: CAP - 0603)
C244  value 0.1u  Voltage: 50V  Package: 0603  [CAP_0603]  (hidden comment: CAP - 0603)
C245  value 1000p  Voltage: 50V  Package: 0603  [CAP_0603]  (hidden comment: CAP - 0603)
C246  value 1000p  Voltage: 50V  Package: 0603  [CAP_0603]  (hidden comment: CAP - 0603)
C247  value 100uF  Voltage: 50V  Package: 1010  Precision: 20%  [CAP_ALU_1010_vishay]  (hidden comment: MAL215099101E3)
C248  value 0.1u  Voltage: 50V  Package: 0603  [CAP_0603]  (hidden comment: CAP - 0603)
C249  value 0.1u  Voltage: 50V  Package: 0603  [CAP_0603]  (hidden comment: CAP - 0603)
R107  value 10k  Package: 0402  Precision: 1%  [RES_0402]  (hidden comment: RES - 0402)
R108  value 10k  Package: 0402  Precision: 1%  [RES_0402]  (hidden comment: RES - 0402)
R109  value 100m  Package: 0402  Precision: 1%  [RES_0402]  (hidden comment: RES - 0402)
R110  value 10k  Package: 0402  Precision: 1%  [RES_0402]  (hidden comment: RES - 0402)
R111  value 10k  Package: 0402  Precision: 1%  [RES_0402]  (hidden comment: RES - 0402)
R112  value 47k  Package: 0402  Precision: 1%  [RES_0402]  (hidden comment: RES - 0402)
R113  value 47k  Package: 0402  Precision: 1%  [RES_0402]  (hidden comment: RES - 0402)
R114  value 100m  Package: 0402  Precision: 1%  [RES_0402]  (hidden comment: RES - 0402)
U21  DRV8811PWPR  [POW_MOTOR_DRV8811PWPR]  (parts A,B,C of 3)

### Ports
DRV8811_AOUT1 (out), DRV8811_AOUT2 (out), DRV8811_BOUT1 (out), DRV8811_BOUT2 (out), DRV8811_DIR (in), DRV8811_EN (in), DRV8811_HOME (out), DRV8811_RESET (in), DRV8811_SLEEP (in), DRV8811_SR (in), DRV8811_STEP (in), DRV8811_USM0 (in), DRV8811_USM1 (in)

### Nets
3V3D: C240.2 R107.2 R110.2 U21.10(VCC)
24V: C242.2 C247.1 C248.2 C249.2 U21.15(VMB) U21.28(VMA)
GND: C240.1 C241.1 C244.1 C245.1 C246.1 C247.2 C248.1 C249.1 R108.2 R109.1 R111.1 R112.1 R113.1 R114.1 U21.7(GND) U21.21(GND) U21.PAD(GND)
DRV8811_AOUT1: U21.4(AOUT1) ; port DRV8811_AOUT1
DRV8811_AOUT2: U21.25(AOUT2) ; port DRV8811_AOUT2
DRV8811_BOUT1: U21.11(BOUT1) ; port DRV8811_BOUT1
DRV8811_BOUT2: U21.18(BOUT2) ; port DRV8811_BOUT2
DRV8811_DIR: U21.3(DIR) ; port DRV8811_DIR
DRV8811_EN: U21.26(~{ENABLE}) ; port DRV8811_EN
DRV8811_HOME: U21.2(HOME) ; port DRV8811_HOME
DRV8811_RESET: U21.17(~{RESET}) ; port DRV8811_RESET
DRV8811_SLEEP: U21.27(~{SLEEP}) ; port DRV8811_SLEEP
DRV8811_SR: U21.16(~{SR}) ; port DRV8811_SR
DRV8811_STEP: U21.19(STEP) ; port DRV8811_STEP
DRV8811_USM0: U21.13(USM0) ; port DRV8811_USM0
DRV8811_USM1: U21.12(USM1) ; port DRV8811_USM1
NetC241_2: C241.2 U21.20(VGD)
NetC242_1: C242.1 U21.22(VCP)
NetC243_1: C243.1 U21.24(CP2)
NetC243_2: C243.2 U21.23(CP1)
NetC244_2: C244.2 R110.1 R111.2 U21.5(DECAY)
NetC245_2: C245.2 R112.2 U21.6(RCA)
NetC246_2: C246.2 R113.2 U21.9(RCB)
NetR107_1: R107.1 R108.1 U21.8(VREF)
NetR109_2: R109.2 U21.1(ISENA)
NetR114_2: R114.2 U21.14(ISENB)

### Notes on the sheet
- Contrôle du moteur
- Découplage 24V moteur
- 100uF près de l'alimentation, 0.1uF sur VMA et sur VMB
- Sheet Name
- Project Title
- Global Project
- Size
- Group
- Revision
- Date
- Sheet
- of
- Filename
- Designers
- (in symbol POW_MOTOR_DRV8811PWPR, part A) Motor Driver Control Logic
- (in symbol POW_MOTOR_DRV8811PWPR, part B) Motor Driver A
- (in symbol POW_MOTOR_DRV8811PWPR, part C) Motor Driver B

### Library data of the parts
C240-C246 C248 C249 = CAP - 0603: Precision: 10%; Current: *; CreatedBy: Jonathan Bouchard; Power: *
C247 = CAP_ALU_MAL215099101E3: CAP - ALU 100uF 20% 50V - 1010; Current: 490mA; Mfg: Vishay Dale; Mfg Part Number: MAL215099101E3; HelpURL: http://www.vishay.com/docs/28395/150crz.pdf; CreatedBy: Jonathan Bouchard; Temperature: -55°C to 125°C; Power: *; Supplier 1: Digikey; Supplier Part Number 1: 4399PHDKR-ND
R107-R114 = RES - 0402: Voltage: 50V; Power: 1/16W; Current: *; CreatedBy: Jonathan Bouchard
U21 = POW_MOTOR_DRV8811PWPR: POW - STEPPER MOTOR DRIVER - SOP-28; Voltage: 3 V ~ 5.5 V / 8 V ~ 38 V; Mfg: Texas Instrument; Current: *; Power: *; Mfg Part Number: DRV8811PWPR; HelpURL: http://www.ti.com/lit/ds/symlink/drv8811.pdf; CreatedBy: Jonathan Bouchard; Temperature: -40°C ~ 150°C (TJ); Value: *; Precision: *; Package: SOP-28; Supplier 1: Digikey; Supplier Part Number 1: 296-24591-1-ND

## Sheet PROB_S7CAS_FLASH-JTAG.SchDoc
size Tabloid; SheetNumber: 15; SheetTotal: 15; Sheet_Name: Mémoire Flash FPGA; Size: 11x17
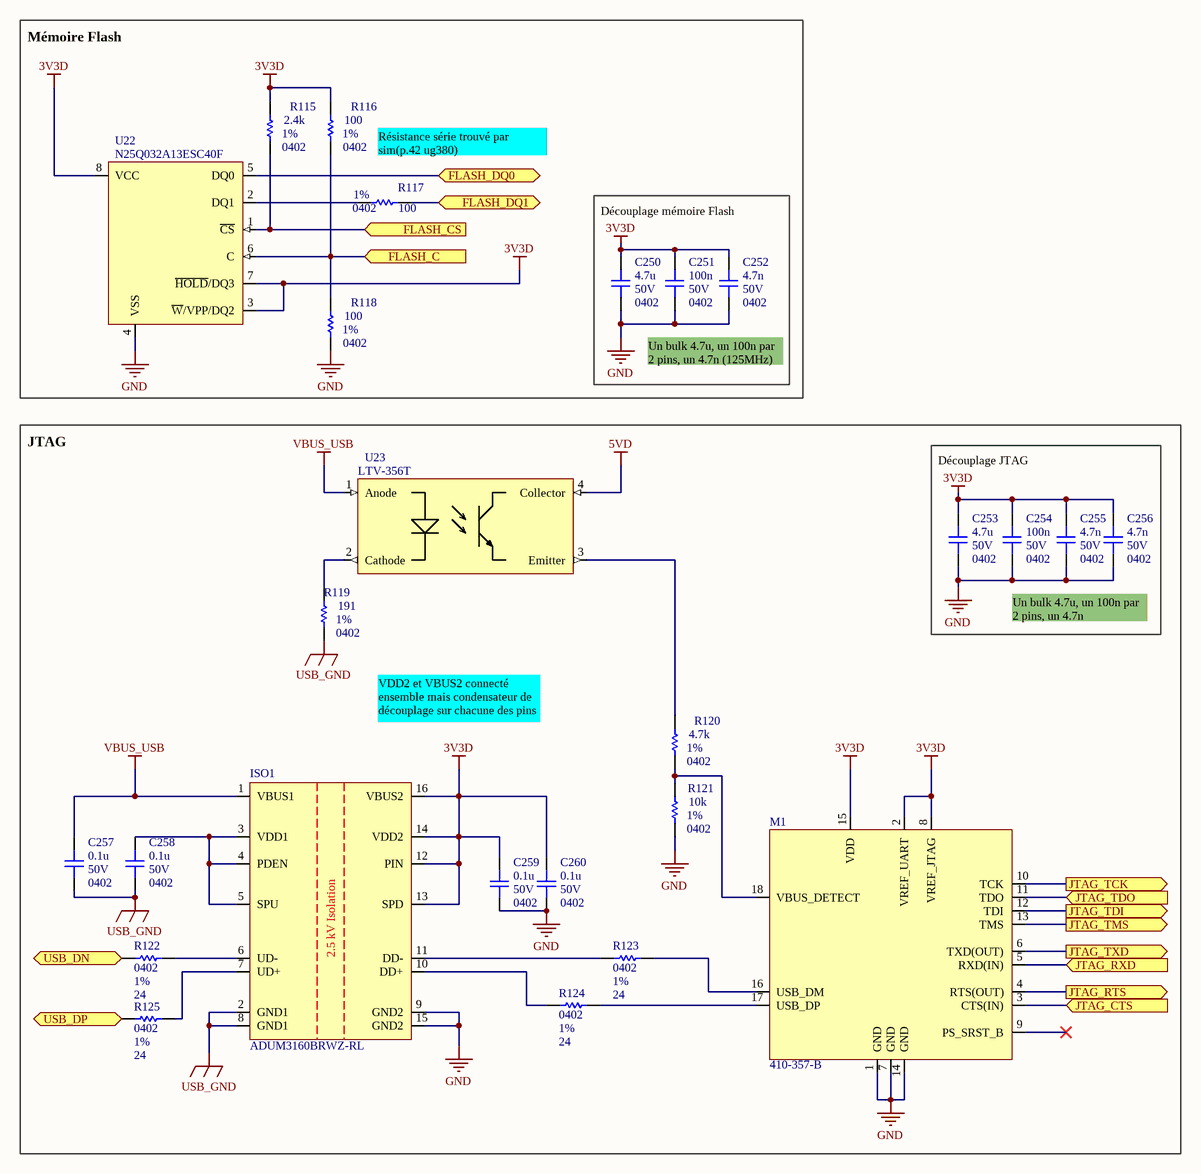
[diagram p14: PROB_S7CAS_FLASH-JTAG.SchDoc]

### Parts
C250  value 4.7u  Voltage: 50V  Package: 0402  [CAP_0402]  (hidden comment: CAP - 0402)
C251  value 100n  Voltage: 50V  Package: 0402  [CAP_0402]  (hidden comment: CAP - 0402)
C252  value 4.7n  Voltage: 50V  Package: 0402  [CAP_0402]  (hidden comment: CAP - 0402)
C253  value 4.7u  Voltage: 50V  Package: 0402  [CAP_0402]  (hidden comment: CAP - 0402)
C254  value 100n  Voltage: 50V  Package: 0402  [CAP_0402]  (hidden comment: CAP - 0402)
C255  value 4.7n  Voltage: 50V  Package: 0402  [CAP_0402]  (hidden comment: CAP - 0402)
C256  value 4.7n  Voltage: 50V  Package: 0402  [CAP_0402]  (hidden comment: CAP - 0402)
C257  value 0.1u  Voltage: 50V  Package: 0402  [CAP_0402]  (hidden comment: CAP - 0402)
C258  value 0.1u  Voltage: 50V  Package: 0402  [CAP_0402]  (hidden comment: CAP - 0402)
C259  value 0.1u  Voltage: 50V  Package: 0402  [CAP_0402]  (hidden comment: CAP - 0402)
C260  value 0.1u  Voltage: 50V  Package: 0402  [CAP_0402]  (hidden comment: CAP - 0402)
ISO1  ADUM3160BRWZ-RL  [ISO_ADUM3160BRWZ-RL]
M1  410-357-B  [MOD_JTAG_410-357-B]
R115  value 2.4k  Package: 0402  Precision: 1%  [RES_0402]  (hidden comment: RES - 0402)
R116  value 100  Package: 0402  Precision: 1%  [RES_0402]  (hidden comment: RES - 0402)
R117  value 100  Package: 0402  Precision: 1%  [RES_0402]  (hidden comment: RES - 0402)
R118  value 100  Package: 0402  Precision: 1%  [RES_0402]  (hidden comment: RES - 0402)
R119  value 191  Package: 0402  Precision: 1%  [RES_0402]  (hidden comment: RES - 0402)
R120  value 4.7k  Package: 0402  Precision: 1%  [RES_0402]  (hidden comment: RES - 0402)
R121  value 10k  Package: 0402  Precision: 1%  [RES_0402]  (hidden comment: RES - 0402)
R122  value 24  Package: 0402  Precision: 1%  [RES_0402]  (hidden comment: RES - 0402)
R123  value 24  Package: 0402  Precision: 1%  [RES_0402]  (hidden comment: RES - 0402)
R124  value 24  Package: 0402  Precision: 1%  [RES_0402]  (hidden comment: RES - 0402)
R125  value 24  Package: 0402  Precision: 1%  [RES_0402]  (hidden comment: RES - 0402)
U22  N25Q032A13ESC40F  [SOIC127P790X216-8N]
U23  LTV-356T  [SOP254P700X240-4N]

### Ports
FLASH_C (in), FLASH_CS (in), FLASH_DQ0 (bidir), FLASH_DQ1 (bidir), JTAG_CTS (in), JTAG_RTS (out), JTAG_RXD (in), JTAG_TCK (out), JTAG_TDI (out), JTAG_TDO (in), JTAG_TMS (out), JTAG_TXD (out), USB_DN (bidir), USB_DP (bidir)

### Nets
3V3D: C250.2 C251.2 C252.2 C253.2 C254.2 C255.2 C256.2 C259.2 C260.2 ISO1.12(PIN) ISO1.13(SPD) ISO1.14(VDD2) ISO1.16(VBUS2) M1.2(VREF_UART) M1.8(VREF_JTAG) M1.15(VDD) R115.2 R116.2 U22.3(~{W}/VPP/DQ2) U22.7(~{HOLD}/DQ3) U22.8(VCC)
5VD: U23.4(Collector)
GND: C250.1 C251.1 C252.1 C253.1 C254.1 C255.1 C256.1 C259.1 C260.1 ISO1.9(GND2) ISO1.15(GND2) M1.1(GND) M1.7(GND) M1.14(GND) R118.1 R121.1 U22.4(VSS)
USB_GND: C257.1 C258.1 ISO1.2(GND1) ISO1.8(GND1) R119.1
VBUS_USB: C257.2 ISO1.1(VBUS1) U23.1(Anode)
DN: R122.2 ; port USB_DN
DP: R125.2 ; port USB_DP
FLASH_C: R116.1 R118.2 U22.6(C) ; port FLASH_C
FLASH_CS: R115.1 U22.1(~{CS}) ; port FLASH_CS
FLASH_DQ0: U22.5(DQ0) ; port FLASH_DQ0
FLASH_DQ1: R117.2 ; port FLASH_DQ1
JTAG_CTS: M1.3(CTS(IN)) ; port JTAG_CTS
JTAG_RTS: M1.4(RTS(OUT)) ; port JTAG_RTS
JTAG_RXD: M1.5(RXD(IN)) ; port JTAG_RXD
JTAG_TCK: M1.10(TCK) ; port JTAG_TCK
JTAG_TDI: M1.12(TDI) ; port JTAG_TDI
JTAG_TDO: M1.11(TDO) ; port JTAG_TDO
JTAG_TMS: M1.13(TMS) ; port JTAG_TMS
JTAG_TXD: M1.6(TXD(OUT)) ; port JTAG_TXD
NetC258_2: C258.2 ISO1.3(VDD1) ISO1.4(PDEN) ISO1.5(SPU)
NetISO1_6: ISO1.6(UD-) R122.1
NetISO1_7: ISO1.7(UD+) R125.1
NetISO1_10: ISO1.10(DD+) R124.2
NetISO1_11: ISO1.11(DD-) R123.2
NetM1_16: M1.16(USB_DM) R123.1
NetM1_17: M1.17(USB_DP) R124.1
NetM1_18: M1.18(VBUS_DETECT) R120.1 R121.2
NetR117_1: R117.1 U22.2(DQ1)
NetR119_2: R119.2 U23.2(Cathode)
NetR120_2: R120.2 U23.3(Emitter)

Not connected (* = marked no-connect by the designer): M1 9(PS_SRST_B)*

### Notes on the sheet
- Mémoire Flash
- Résistance série trouvé par sim(p.42 ug380)
- Découplage mémoire Flash
- Un bulk 4.7u, un 100n par 2 pins, un 4.7n (125MHz)
- JTAG
- Découplage JTAG
- Un bulk 4.7u, un 100n par 2 pins, un 4.7n
- VDD2 et VBUS2 connecté ensemble mais condensateur de découplage sur chacune des pins
- Sheet Name
- Project Title
- Global Project
- Size
- Group
- Revision
- Date
- Sheet
- of
- Filename
- Designers
- (in symbol ISO_ADUM3160BRWZ-RL) 2.5 kV Isolation

### Library data of the parts
C250-C260 = CAP - 0402: Precision: 10%; Current: *; CreatedBy: Jonathan Bouchard; Power: *
ISO1 = ISO_ADUM3160BRWZ-RL: ISO - DGTL ISO 2.5KV 2CH USB - 16SOIC; Manufacturer #1: Analog Devices; Value: 2500Vrms voltage isolation; Voltage Rating: 3~5.5V; GRAMS Lib Spec: 2.8; Magnetic Material: UNKNOWN; Polarized: Yes; Tolerance: *; Current Rating: *; Power Max: *; HelpURL: https://www.analog.com/media/en/technical-documentation/data-sheets/ADuM3160.pdf; CreatedBy/Date: Tommy Rossignol 2018-11-16; VerifiedBy: Caroline Paulin - 13 février 2019; Temperature: -40°C ~ 105°C; Package: 16-SOIC; Manufacturer #2: *; Assembly Type: SMD; Part Number #2: *; Part Number #1: ADUM3160BRWZ-RL; Supplier 1: Digi-Key; Supplier Part Number 1: ADUM3160BRWZ-RLCT-ND; Cryo: UNKNOWN
M1 = MOD_JTAG_410-357-B: MOD - JTAG-SMT3-NC Programming Module For Xilinx FPGA - 18-SMT; Manufacturer #1: Digilent; Voltage Rating: VDD: 2.97V~3.63V, VJTAG/VUART: 1.65V~5.5V; GRAMS Lib Spec: 2.8; Note: Prior to reflow, the JTAG-SMT3-NC module must be dried at 125°C for 17 hours; Magnetic Material: Unknown; Polarized: Yes; Value: *; Tolerance: *; Current Rating: *; Power Max: *; HelpURL: https://reference.digilentinc.com/_media/reference/programmers/jtag-smt3/jtag-smt3-nc_rm.pdf; CreatedBy/Date: Tommy Rossignol 2018-11-23; VerifiedBy: Nicolas V. (2019-01-28); Temperature: -40°C ~ 85°C; Package: 18-pad SMT; Manufacturer #2: *; Assembly Type: SMD; Part Number #2: *; Part Number #1: 410-357-B; Supplier 1: Digi-Key; Supplier Part Number 1: 1286-1196-ND; Cryo: UNKNOWN
R115-R125 = RES - 0402: Voltage: 50V; Power: 1/16W; Current: *; CreatedBy: Jonathan Bouchard
U22 = IC FLASH 32MBIT SPI 108MHZ 8SO: N25Q032A - 32Mb, 3V, Multiple I/O Serial Flash Memory - 8-SOIC (0.209", 5.30mm Width); GRAMS Lib Spec: 2.7; HelpURL: https://www.alliancememory.com/wp-content/uploads/pdf/micron/Micron_Datasheet_N25Q032A_RevJ.pdf
U23 = LTV-356T: LTV-356T - OPTOISOLATOR 3.75KV TRANS - 4-SOP; GRAMS Lib Spec: 2.7; HelpURL: https://optoelectronics.liteon.com/upload/download/DS70-2001-010/LTV-356T%20series%20Rev.P.PDF